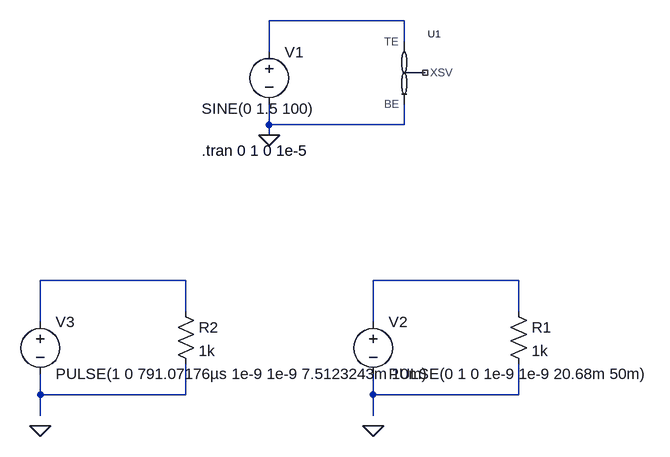
[diagram p0: schematic 修改的通用型忆阻器用于逻辑.asc]
修改的通用型忆阻器用于逻辑.asc, the LTspice schematic file:
Version 4
SHEET 1 880 724
WIRE 288 80 80 80
WIRE 288 112 288 80
WIRE 80 128 80 80
WIRE 80 240 80 208
WIRE 288 240 288 208
WIRE 288 240 80 240
WIRE 80 256 80 240
WIRE -48 480 -272 480
WIRE 464 480 240 480
WIRE -48 528 -48 480
WIRE 464 528 464 480
WIRE -272 544 -272 480
WIRE 240 544 240 480
WIRE -272 656 -272 624
WIRE -48 656 -48 608
WIRE -48 656 -272 656
WIRE 240 656 240 624
WIRE 464 656 464 608
WIRE 464 656 240 656
WIRE -272 688 -272 656
WIRE 240 688 240 656
FLAG 80 256 0
FLAG 240 704 0
FLAG -272 704 0
SYMBOL voltage 80 112 R0
WINDOW 3 -104 103 Left 2
WINDOW 123 0 0 Left 0
WINDOW 39 0 0 Left 0
SYMATTR Value SINE(0 1.5 100)
SYMATTR InstName V1
SYMBOL MEM_YAKOPCIC 288 160 R0
SYMATTR InstName U1
SYMBOL voltage 240 528 R0
WINDOW 123 0 0 Left 0
WINDOW 39 0 0 Left 0
SYMATTR InstName V2
SYMATTR Value PULSE(0 1 0 1e-9 1e-9 20.68m 50m)
SYMBOL res 448 512 R0
SYMATTR InstName R1
SYMATTR Value 1k
SYMBOL voltage -272 528 R0
WINDOW 123 0 0 Left 0
WINDOW 39 0 0 Left 0
SYMATTR InstName V3
SYMATTR Value PULSE(1 0 791.07176µs 1e-9 1e-9 7.5123243m 10m)
SYMBOL res -64 512 R0
SYMATTR InstName R2
SYMATTR Value 1k
TEXT -24 280 Left 2 !.tran 0 1 0 1e-5

The netlist it stands for:
* 修改的通用型忆阻器用于逻辑.asc
V1 N001 0 SINE(0 1.5 100)
XU1 N001 0 NC_01 MEM_YAKOPCIC  ; pins TE BE XSV
V2 N003 N005 PULSE(0 1 0 1e-9 1e-9 20.68m 50m)
R1 N003 N005 1k
V3 N002 N004 PULSE(1 0 791.07176µs 1e-9 1e-9 7.5123243m 10m)
R2 N002 N004 1k
.tran 0 1 0 1e-5
.lib MEM_YAKOPCIC.sub
.backanno
.end